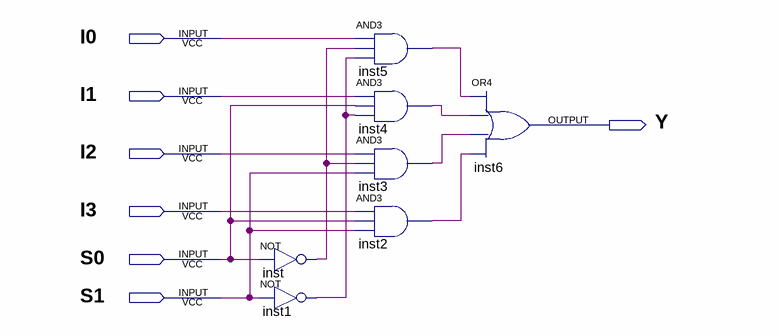
[diagram p0: schematic sheet]
// Quartus schematic 4x1_Mux.bdf as structural Verilog: 7 symbols, 7 pins
module \4x1_Mux  (
  input  I0,
  input  I1,
  input  I2,
  input  I3,
  input  S0,
  input  S1,
  output Y
);

  wire inst1_out, inst2_out, inst3_out, inst4_out, inst5_out, inst_out;

  not inst (inst_out, S0);
  not inst1 (inst1_out, S1);
  and inst5 (inst5_out, I0, inst_out, inst1_out);
  and inst4 (inst4_out, I1, S0, inst1_out);
  and inst3 (inst3_out, I2, inst_out, S1);
  and inst2 (inst2_out, I3, S0, S1);
  or inst6 (Y, inst5_out, inst4_out, inst3_out, inst2_out);
endmodule
